# Altium schematic sheet [4] CAN RS4XX INTERFACES.SchDoc
size 431 x 279 mm; SheetNumber: 6; SheetTotal: 9
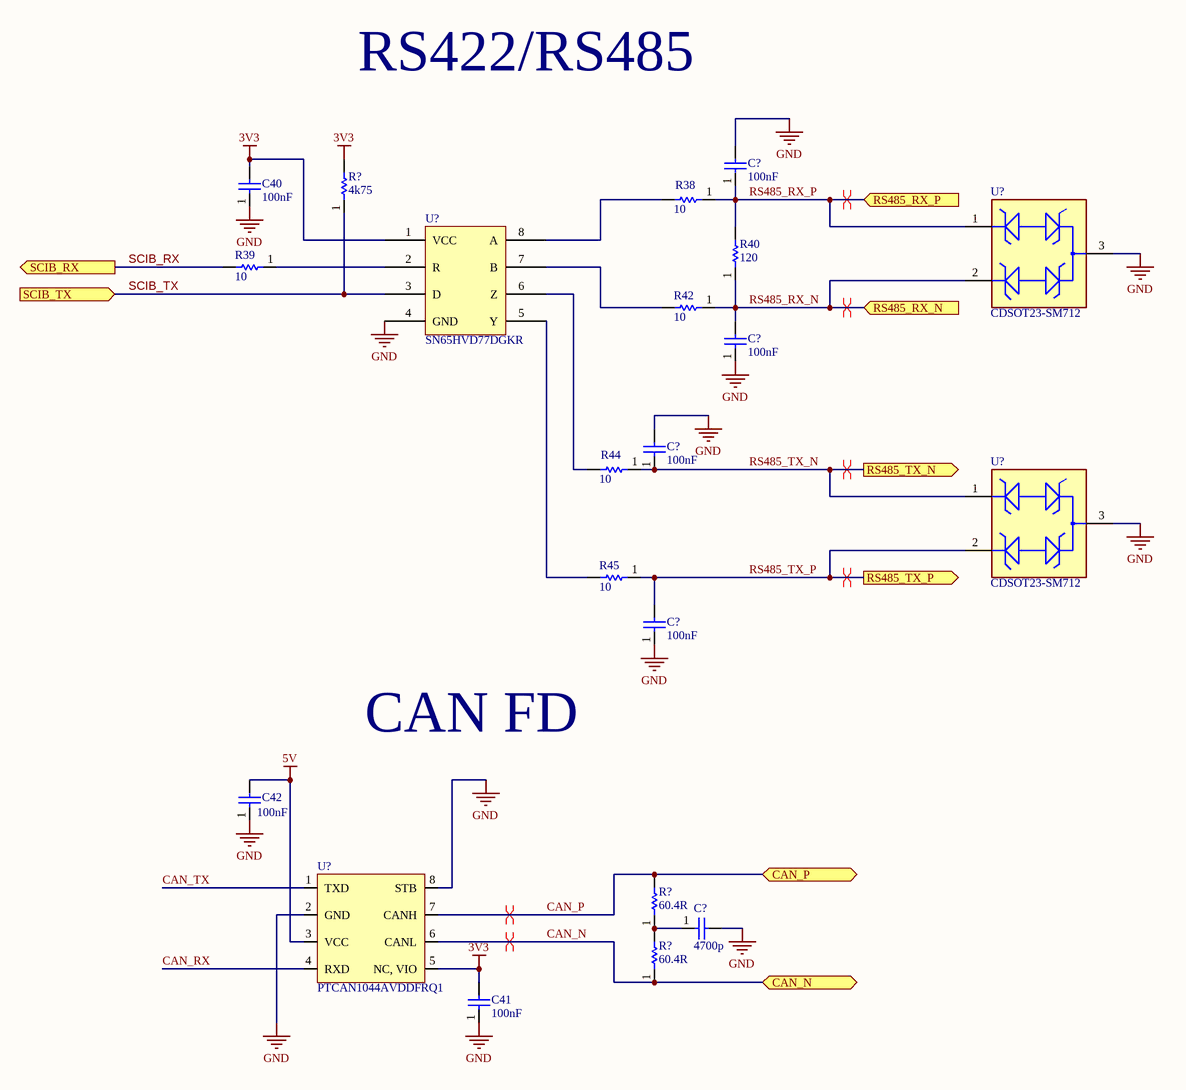
[diagram p0: [4] CAN RS4XX INTERFACES.SchDoc]

## Parts
(Parts that share a designator on the sheet are numbered #1, #2 ... from top to bottom, then left to right.)
C40  value 100nF  [CAPC1005X03N(0402)]  (hidden comment: GRM155R71C104JA88D)
C41  value 100nF  [CAPC1005X03N(0402)]  (hidden comment: GRM155R71C104JA88D)
C42  value 100nF  [CAPC1005X03N(0402)]  (hidden comment: GRM155R71C104JA88D)
C?#1  value 100nF  [CAPC1005X03N(0402)]  (hidden comment: GRM155R71C104JA88D)
C?#2  value 100nF  [CAPC1005X03N(0402)]  (hidden comment: GRM155R71C104JA88D)
C?#3  value 100nF  [CAPC1005X03N(0402)]  (hidden comment: GRM155R71C104JA88D)
C?#4  value 100nF  [CAPC1005X03N(0402)]  (hidden comment: GRM155R71C104JA88D)
C?#5  value 4700p  [0603_C]  (hidden comment: CGA3E2X8R1H472K080AA)
R38  value 10  [0402]  (hidden comment: ERA-2AKD100X)
R39  value 10  [0402]  (hidden comment: ERA-2AKD100X)
R40  value 120  [0603]  (hidden comment: RC0603FR-07120RL)
R42  value 10  [0402]  (hidden comment: ERA-2AKD100X)
R44  value 10  [0402]  (hidden comment: ERA-2AKD100X)
R45  value 10  [0402]  (hidden comment: ERA-2AKD100X)
R?#1  value 4k75  [RESC1005X06N(0402)]  (hidden comment: RC0402FR-074K75L)
R?#2  value 60.4R  [RESC1608X09N(0603)]  (hidden comment: ERA-3AEB60R4V)
R?#3  value 60.4R  [RESC1608X09N(0603)]  (hidden comment: ERA-3AEB60R4V)
U?#1  CDSOT23-SM712  [FP-SOT23-IPC_C - BOUNS]
U?#2  SN65HVD77DGKR  [SOP65P490X110-8N_VSSOP-8]
U?#3  CDSOT23-SM712  [FP-SOT23-IPC_C - BOUNS]
U?#4  PTCAN1044AVDDFRQ1  [SOT-23_DDF0008A]

## Ports
CAN_N (bidir), CAN_P (bidir), RS485_RX_N (in), RS485_RX_P (in), RS485_TX_N (out), RS485_TX_P (out), SCIB_RX (out), SCIB_TX (in)

## Nets
3V3: C40.2 C41.2 R?#1.2 U?#2.1(VCC) U?#4.5(NC,_VIO)
5V: C42.2 U?#4.3(VCC)
GND: C40.1 C41.1 C42.1 C?#1.2 C?#2.1 C?#3.2 C?#4.1 C?#5.2 U?#1.3 U?#2.4(GND) U?#3.3 U?#4.2(GND) U?#4.8(STB)
CAN_N: R?#3.1 U?#4.6(CANL) ; port CAN_N
CAN_P: R?#2.2 U?#4.7(CANH) ; port CAN_P
CAN_RX: U?#4.4(RXD)
CAN_TX: U?#4.1(TXD)
RS485_RX_N: C?#2.2 R40.1 R42.1 U?#1.2 ; port RS485_RX_N
RS485_RX_P: C?#1.1 R38.1 R40.2 U?#1.1 ; port RS485_RX_P
RS485_TX_N: C?#3.1 R44.1 U?#3.1 ; port RS485_TX_N
RS485_TX_P: C?#4.2 R45.1 U?#3.2 ; port RS485_TX_P
SCIB_RX: R39.2 ; port SCIB_RX
SCIB_TX: R?#1.1 U?#2.3(D) ; port SCIB_TX
NetC?#5_1: C?#5.1 R?#2.1 R?#3.2
NetR38_2: R38.2 U?#2.8(A)
NetR39_1: R39.1 U?#2.2(R)
NetR42_2: R42.2 U?#2.7(B)
NetR44_2: R44.2 U?#2.6(Z)
NetR45_2: R45.2 U?#2.5(Y)

## Layout directives
differential pair: CAN_N, CAN_P, RS485_RX_N, RS485_RX_P, RS485_TX_N, RS485_TX_P

## Notes on the sheet
- RS422/RS485
- CAN FD
- REVISION
- DESCRIPTION
- DATE
- PROJECT:
- AUTHOR:
- TITLE:
- FILE NAME:
- REVISION:
- PCB:
- SHEET:
- DATE:
- OF

## Library data of the parts
C40-C42 C?#1-C?#4 = 100nF_16V_0402_CAP: CAP CER 0.1UF 16V X7R 0402; Tolerance: 5%; MPN: GRM155R71C104JA88D; Voltage Rating: 16V; Temp Coeff: X7R; Size/Package: 0402
C?#5 = 4700pF_50V_0603_CGA3E2X8R1H472K080AA: Cap Ceramic 0.0047uF 50V X8R 10% SMD 0603 150C Paper T/R; Manufacturer: TDK; Capacitance: 4.7nF; Supplier 1: Digi-Key; Manufacturer Part Number: CGA3E2X8R1H472K080AA; RoHS: Yes; Category: Ceramic Capacitors; Stock 1: 19830; Pricing 1: 1=0,13000, 10=0,09600, 50=0,05420, 100=0,04500, 500=0,03154, 1000=0,02611 (USD); Mount: Surface Mount; Case/Package: 0603; Case Code (Metric): 1608; Case Code (Imperial): 0603; Weight: 7.1E-05oz; Min Operating Temperature: -55°C; Max Operating Temperature: 150°C; Voltage Rating: 50V; Tolerance: 10%; Packaging: Tape and Reel; Voltage Rating (DC): 50V; Dielectric: X8R; Termination: SMD/SMT; Series: CGA; Package Quantity: 1; Resistor Type: Ceramic; Features: High Temperature; Length: 1.6mm; Width: 0.031inch; Height: 0.8mm; Thickness: 0.035inch; Depth: 0.8mm; Ratings: AEC-Q200; REACH SVHC: No SVHC; ComponentLink1URL: https://datasheet.ciiva.com/24219/cga3e2x8r1h472k080aa-265940-24219316.pdf?src-supplier=Mouser; ComponentLink1Description: https://datasheet.ciiva.com/24219/cga3e2x8r1h472k080aa-265940-24219316.pdf?src-supplier=Mouser; Supplier Part Number 1: 445-5890-1-ND
R38 R39 R42 R44 R45 = 10R_0402_0.5%_ERA-2AKD100X: Res Thin Film 0402 10 Ohm 0.5% 1/16W 100ppm/C Molded SMD SMD Punched Carrier T/R; Manufacturer: Panasonic; Resistance: 10R; Power Rating: 63mW; Voltage Rating: 25V; Temperature Coefficient: 100ppm/°C; Supplier 1: Digi-Key; Manufacturer Part Number: ERA-2AKD100X; RoHS: Yes; Category: Chip SMD Resistors; Stock 1: 304; Pricing 1: 1=0.10000, 10=0.06500, 100=0.02660, 1000=0.01192, 2500=0.01035, 5000=0.00855 (USD); Mount: Surface Mount; Case/Package: 0402; Case Code (Metric): 1005; Case Code (Imperial): 0402; Contact Plating: Tin; Min Operating Temperature: -55°C; Max Operating Temperature: 155°C; Packaging: Tape and Reel; Tolerance: 0.5%; Package Quantity: 10000; Resistor Type: Thin Film,Metal Film; Number of Terminations: 2; Max Power Dissipation: 63mW; Series: ERA-2A; Construction: Rectangular; Length: 1mm; Width: 0.02inch; Height: 0.016inch; Depth: 0.5mm; Radiation Hardening: No; Military Standard: Not; Lead Free: Lead Free; RoHS Compliant: Yes; ComponentLink1URL: https://datasheet.ciiva.com/9117/aoa0000ce26-9117292.pdf?src-supplier=Avnet; ComponentLink1Description: https://datasheet.ciiva.com/9117/aoa0000ce26-9117292.pdf?src-supplier=Avnet; ComponentLink2URL: https://datasheet.ciiva.com/24026/aoa0000ce26-32660-24026776.pdf?src-supplier=Mouser; ComponentLink2Description: https://datasheet.ciiva.com/24026/aoa0000ce26-32660-24026776.pdf?src-supplier=Mouser; ComponentLink3URL: https://datasheet.ciiva.com/30256/54aoa0000ce26-30256601.pdf?src-supplier=Onlinecomponents.com; ComponentLink3Description: https://datasheet.ciiva.com/30256/54aoa0000ce26-30256601.pdf?src-supplier=Onlinecomponents.com; Supplier Part Number 1: P10DDCT-ND
R40 = 120R_0603_1%_1/10W_RC0603FR-07120RL_RES: Res Thick Film 0603 120 Ohm 1% 0.1W(1/10W) ±100ppm/C Epoxy SMD T/R; Manufacturer: Yageo; Resistance: 120R; Temperature Coefficient: 100ppm/°C; Voltage Rating (DC): 50V; Power Rating: 100mW; Supplier 1: Digi-Key; Manufacturer Part Number: RC0603FR-07120RL; RoHS: Yes; Category: Chip SMD Resistors; Stock 1: 490265; Pricing 1: 1=0.10000, 10=0.02400, 100=0.00970, 1000=0.00436, 2500=0.00378 (USD); Case/Package: 0603; Number of Pins: 2; Case Code (Metric): 1608; Case Code (Imperial): 0603; Size Code: 0603; Min Operating Temperature: -55°C; Max Operating Temperature: 155°C; Resistor Type: Thick Film; Tolerance: 1%; Packaging: Tape and Reel; Voltage Rating: 50V; Package Quantity: 1; Number of Terminations: 2; Termination: SMD/SMT; Max Power Dissipation: 100mW; Features: Moisture Resistant; Series: RC; Construction: Rectangular; Resistance Tolerance: 1%; Length: 1.6mm; Width: 0.031inch; Height: 0.022inch; Depth: 0.8mm; REACH SVHC: No SVHC; Lead Free: Lead Free; Military Standard: Not; RoHS Compliant: Yes; ComponentLink1URL: https://datasheet.ciiva.com/2553/pyu-r-int-thick-7-2553512.pdf?src-supplier=Digi-Key; ComponentLink1Description: https://datasheet.ciiva.com/2553/pyu-r-int-thick-7-2553512.pdf?src-supplier=Digi-Key; ComponentLink2URL: https://datasheet.ciiva.com/2553/pyu-r-int-thick-7-2553513.pdf?src-supplier=Digi-Key; ComponentLink2Description: https://datasheet.ciiva.com/2553/pyu-r-int-thick-7-2553513.pdf?src-supplier=Digi-Key; ComponentLink3URL: https://datasheet.ciiva.com/2553/pyu-r-int-thick-7-2553514.pdf?src-supplier=Digi-Key; ComponentLink3Description: https://datasheet.ciiva.com/2553/pyu-r-int-thick-7-2553514.pdf?src-supplier=Digi-Key; ComponentLink4URL: https://datasheet.ciiva.com/46395/443971-46395021.pdf?src-supplier=Element14; ComponentLink4Description: https://datasheet.ciiva.com/46395/443971-46395021.pdf?src-supplier=Element14; ComponentLink5URL: https://datasheet.ciiva.com/7746/443971-7746248.pdf?src-supplier=Element14; ComponentLink5Description: https://datasheet.ciiva.com/7746/443971-7746248.pdf?src-supplier=Element14; ComponentLink6URL: https://datasheet.ciiva.com/7746/443971-7746249.pdf?src-supplier=Element14; ComponentLink6Description: https://datasheet.ciiva.com/7746/443971-7746249.pdf?src-supplier=Element14; Supplier Part Number 1: 311-120HRCT-ND
R?#1 = 4k75_1/16_0402_RES: RES SMD 4.75K OHM 1% 1/16W 0402; Power: 1/16; MPN: RC0402FR-074K75L; Tolerance: 1%; Package/Case: 0402
R?#2 R?#3 = 60.4R_1/10W_0603_RES: RES SMD 60.4 OHM 0.1% 1/10W 0603; Wattage: 0.1W; MPN: ERA-3AEB60R4V; Tolerance: 0.1%; Drawn By: TC; Checked By: *; Supplier 1: Digi-Key; Supplier Part Number 1: P60.4DBCT-ND
U?#1 U?#3 = TVS_RS485_SOT23_CDSOT23-SM712: BOURNS - CDSOT23-SM712 - Transient Voltage Suppressor, TVS, CDSOT23 Series, Unidirectional, 12 V, SOT-23, 3, 13.3 V; Direction: Bidirectional; Clamping Voltage: 19V; Working Voltage: 12V; Max Surge Current: 30A; Polarity: Bidirectional,Unidirectional; Breakdown Voltage: 13.3V; Power Line Protection: No; Leakage Current: 20uA; Peak Pulse Current: 17A; Element Configuration: Dual; Diode Type: ZENER; Capacitance: 75pF; Number of Elements: 2; Max Power Dissipation: 600W; Peak Pulse Power: 400W; Test Current: 1mA; ESD Protection: Yes; Supplier 1: Digi-Key; Manufacturer: Bourns; Manufacturer Part Number: CDSOT23-SM712; RoHS: Yes; Category: TVS Diodes; Pricing 1: 1=1,63000, 10=1,46000, 100=1,13850, 500=0,94050, 1000=0,74250 (USD); Mount: Surface Mount; Case/Package: SOT-23; Number of Pins: 3; Contact Plating: Tin; Min Operating Temperature: -55°C; Max Operating Temperature: 150°C; Packaging: Tape and Reel; Package Quantity: 1; Series: -; Termination: SMD/SMT; Reverse Standoff Voltage: 12V; Min Breakdown Voltage: 13.3V; Resistor Type: Zener; Reverse Breakdown Voltage: 13.3V; Number of Channels: 2; Number of Bidirectional Channels: 2; Power Dissipation: 400W; Max Reverse Leakage Current: 20uA; Max Breakdown Voltage: 13.3V; Length: 3.04mm; Width: 0.055inch; Height: 1.11mm; Depth: 1.4mm; Radiation Hardening: No; REACH SVHC: No SVHC; RoHS Compliant: Yes; ComponentLink1URL: https://datasheet.ciiva.com/1281/1670933-1281331.pdf?src-supplier=Farnell; ComponentLink1Description: https://datasheet.ciiva.com/1281/1670933-1281331.pdf?src-supplier=Farnell; ComponentLink2URL: https://datasheet.ciiva.com/4510/cdsot23-sm712-25932-4510261.pdf?src-supplier=Mouser; ComponentLink2Description: https://datasheet.ciiva.com/4510/cdsot23-sm712-25932-4510261.pdf?src-supplier=Mouser; ComponentLink3URL: https://datasheet.ciiva.com/11193/cdsot23-sm712-11193846.pdf?src-supplier=Avnet; ComponentLink3Description: https://datasheet.ciiva.com/11193/cdsot23-sm712-11193846.pdf?src-supplier=Avnet; ComponentLink4URL: https://datasheet.ciiva.com/16582/cdsot23-sm712-16582189.pdf?src-supplier=Avnet+Europe; ComponentLink4Description: https://datasheet.ciiva.com/16582/cdsot23-sm712-16582189.pdf?src-supplier=Avnet+Europe; ComponentLink5URL: https://datasheet.ciiva.com/337/cdsot23-sm712-337451.pdf?src-supplier=Digi-Key; ComponentLink5Description: https://datasheet.ciiva.com/337/cdsot23-sm712-337451.pdf?src-supplier=Digi-Key; ComponentLink6URL: https://datasheet.ciiva.com/337/cdsot23-sm712-337452.pdf?src-supplier=Digi-Key; ComponentLink6Description: https://datasheet.ciiva.com/337/cdsot23-sm712-337452.pdf?src-supplier=Digi-Key; ComponentLink7URL: https://datasheet.ciiva.com/26828/getdatasheetpartid-418501-26828522.pdf?src-supplier=Verical; ComponentLink7Description: https://datasheet.ciiva.com/26828/getdatasheetpartid-418501-26828522.pdf?src-supplier=Verical; ComponentLink8URL: https://datasheet.ciiva.com/22696/1670933-22696779.pdf?src-supplier=Element14; ComponentLink8Description: https://datasheet.ciiva.com/22696/1670933-22696779.pdf?src-supplier=Element14; Supplier Part Number 1: CDSOT23-SM712DKR-ND
U?#2 = RS422/485_SN65HVD77DGKR_VSSOP-8: TEXAS INSTRUMENTS         SN65HVD77D            Transceiver RS485 Driver, 3V-3.6V Supply, SOIC-8; Data Rate: 50Mbps; Number of Transmitters: 1; Operating Supply Voltage: 3.3V; Logic Function: Receiver; Simplex/Duplex: Full Duplex; Min Supply Voltage: 3V; Max Supply Voltage: 3.6V; Interface: RS-485; Supplier 1: Digi-Key; Manufacturer: Texas Instruments; Manufacturer Part Number: SN65HVD77D; RoHS: Yes; Category: RS-232 / RS-422 / RS-485 Interface ICs; Stock 1: 179; Pricing 1: 1=4,84000, 10=4,34700, 25=4,10920, 100=3,56140, 250=3,37880, 500=3,03180, 1000=3,01525 (USD); Case/Package: SOIC; Number of Pins: 8; Min Operating Temperature: -40°C; Max Operating Temperature: 125°C; Packaging: Cut Tape; Number of Drivers: 1; Lead Free: Lead Free; RoHS Compliant: Yes; REACH SVHC: No SVHC; ComponentLink1URL: https://datasheet.ciiva.com/48475/sn65hvd70-48475479.pdf?src-supplier=Avnet; ComponentLink1Description: https://datasheet.ciiva.com/48475/sn65hvd70-48475479.pdf?src-supplier=Avnet; ComponentLink2URL: https://datasheet.ciiva.com/46436/1855982-46436103.pdf?src-supplier=Element14; ComponentLink2Description: https://datasheet.ciiva.com/46436/1855982-46436103.pdf?src-supplier=Element14; Supplier Part Number 1: 296-46537-5-ND
U?#4 = CAN_FD_TRANSCEIVER_PTCAN1044AVDDFRQ1_SOT23: Automotive Fault-Protected CAN FD / Transceiver with Standby mode; MPN: PTCAN1044AVDDFRQ1